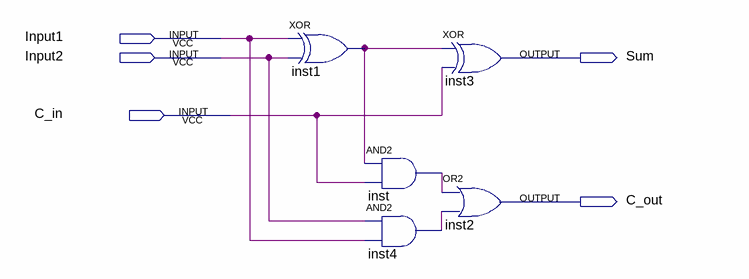
[diagram p0: schematic sheet]
// Quartus schematic Adder_1b.bdf as structural Verilog: 5 symbols, 5 pins
module Adder_1b (
  input  Input1,
  input  Input2,
  input  C_in,
  output Sum,
  output C_out
);

  wire inst1_out, inst4_out, inst_out;

  xor inst1 (inst1_out, Input1, Input2);
  and inst (inst_out, inst1_out, C_in);
  and inst4 (inst4_out, Input2, Input1);
  xor inst3 (Sum, inst1_out, C_in);
  or inst2 (C_out, inst_out, inst4_out);
endmodule
